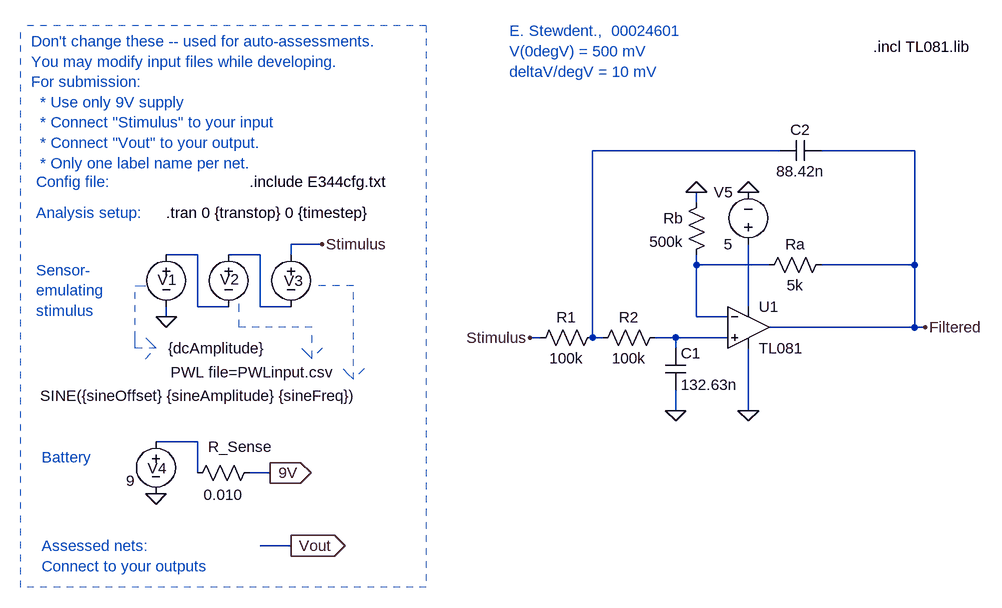
[diagram p0: schematic _Noninverting_2nd_Order_TL081.asc]
_Noninverting_2nd_Order_TL081.asc, the LTspice schematic file:
Version 4
SHEET 1 1824 680
WIRE -1136 -1216 -1424 -1216
WIRE -928 -1216 -1072 -1216
WIRE -1264 -1136 -1264 -1152
WIRE -1840 -1072 -1888 -1072
WIRE -2032 -1056 -2080 -1056
WIRE -1936 -1056 -1984 -1056
WIRE -1888 -1056 -1888 -1072
WIRE -1264 -1040 -1264 -1056
WIRE -1152 -1040 -1264 -1040
WIRE -928 -1040 -928 -1216
WIRE -928 -1040 -1072 -1040
WIRE -2032 -976 -2032 -1056
WIRE -1984 -976 -2032 -976
WIRE -1936 -976 -1936 -1056
WIRE -1888 -976 -1936 -976
WIRE -1184 -976 -1184 -1072
WIRE -2080 -960 -2080 -976
WIRE -1264 -960 -1264 -1040
WIRE -1216 -960 -1264 -960
WIRE -928 -944 -928 -1040
WIRE -928 -944 -1152 -944
WIRE -912 -944 -928 -944
WIRE -1504 -928 -1520 -928
WIRE -1424 -928 -1424 -1216
WIRE -1408 -928 -1424 -928
WIRE -1296 -928 -1328 -928
WIRE -1216 -928 -1296 -928
WIRE -1296 -912 -1296 -928
WIRE -1296 -816 -1296 -848
WIRE -1184 -816 -1184 -912
WIRE -2032 -768 -2096 -768
WIRE -2032 -720 -2032 -768
WIRE -1920 -720 -1952 -720
WIRE -1888 -608 -1936 -608
FLAG -2080 -960 0
FLAG -1840 -1072 Stimulus
FLAG -1920 -720 9V
IOPIN -1920 -720 Out
FLAG -2096 -688 0
FLAG -1888 -608 Vout
IOPIN -1888 -608 Out
FLAG -1520 -928 Stimulus
FLAG -912 -944 Filtered
FLAG -1184 -816 0
FLAG -1296 -816 0
FLAG -1184 -1152 0
FLAG -1264 -1152 0
SYMBOL voltage -1984 -1072 R0
WINDOW 123 0 0 Left 0
WINDOW 39 0 0 Left 0
WINDOW 3 -89 197 Left 2
WINDOW 0 -13 54 Left 2
SYMATTR Value PWL file=PWLinput.csv
SYMATTR InstName V2
SYMBOL voltage -1888 -1072 R0
WINDOW 123 24 44 Left 2
WINDOW 39 0 0 Left 0
WINDOW 3 -386 233 Left 2
WINDOW 0 -11 56 Left 2
SYMATTR Value SINE({sineOffset} {sineAmplitude} {sineFreq})
SYMATTR InstName V3
SYMBOL voltage -2080 -1072 R0
WINDOW 123 0 0 Left 0
WINDOW 39 0 0 Left 0
WINDOW 3 3 160 Left 2
WINDOW 0 -13 55 Left 2
SYMATTR Value {dcAmplitude}
SYMATTR InstName V1
SYMBOL voltage -2096 -784 R0
WINDOW 123 24 44 Left 2
WINDOW 39 0 0 Left 0
WINDOW 3 -46 76 Left 2
WINDOW 0 -13 57 Left 2
SYMATTR Value 9
SYMATTR InstName V4
SYMBOL res -1936 -736 R90
WINDOW 0 -9 30 VBottom 2
WINDOW 3 34 56 VTop 2
SYMATTR InstName R_Sense
SYMATTR Value 0.010
SYMBOL res -1408 -944 R90
WINDOW 0 0 56 VBottom 2
WINDOW 3 32 56 VTop 2
SYMATTR InstName R1
SYMATTR Value 100k
SYMBOL cap -1312 -912 R0
SYMATTR InstName C1
SYMATTR Value 132.63n
SYMBOL Opamps\\opamp2 -1184 -1008 R0
SYMATTR InstName U1
SYMATTR Value TL081
SYMBOL voltage -1184 -1056 R180
WINDOW 0 24 96 Left 2
WINDOW 3 24 16 Left 2
WINDOW 123 0 0 Left 0
WINDOW 39 0 0 Left 0
SYMATTR InstName V5
SYMATTR Value 5
SYMBOL res -1312 -944 R90
WINDOW 0 0 56 VBottom 2
WINDOW 3 32 56 VTop 2
SYMATTR InstName R2
SYMATTR Value 100k
SYMBOL res -1056 -1056 R90
WINDOW 0 0 56 VBottom 2
WINDOW 3 32 56 VTop 2
SYMATTR InstName Ra
SYMATTR Value 5k
SYMBOL res -1248 -1152 M0
SYMATTR InstName Rb
SYMATTR Value 500k
SYMBOL cap -1072 -1232 R90
WINDOW 0 0 32 VBottom 2
WINDOW 3 32 32 VTop 2
SYMATTR InstName C2
SYMATTR Value 88.42n
TEXT -2080 -1120 Left 2 !.tran 0 {transtop} 0 {timestep}
TEXT -1952 -1168 Left 2 !.include E344cfg.txt
TEXT -2288 -1384 Left 2 ;Don't change these -- used for auto-assessments.\nYou may modify input files while developing.\nFor submission: \n  * Use only 9V supply \n  * Connect "Stimulus" to your input\n  * Connect "Vout" to your output.\n  * Only one label name per net.
TEXT -2280 -1168 Left 2 ;Config file:
TEXT -2280 -1120 Left 2 ;Analysis setup:
TEXT -2272 -744 Left 2 ;Battery
TEXT -2280 -1032 Left 2 ;Sensor-\nemulating \nstimulus
TEXT -2272 -608 Left 2 ;Assessed nets:\nConnect to your outputs
TEXT -1552 -1400 Left 2 ;E. Stewdent.,  00024601\nV(0degV) = 500 mV\ndeltaV/degV = 10 mV
TEXT -992 -1376 Left 2 !.incl TL081.lib
LINE Normal -1792 -1008 -1856 -1008 2
LINE Normal -1792 -864 -1792 -1008 2
LINE Normal -1808 -880 -1792 -864 2
LINE Normal -1792 -864 -1808 -880 2
LINE Normal -1776 -880 -1792 -864 2
LINE Normal -2128 -1008 -2112 -1008 2
LINE Normal -2128 -928 -2128 -1008 2
LINE Normal -2128 -912 -2128 -928 2
LINE Normal -2096 -912 -2128 -912 2
LINE Normal -2112 -928 -2096 -912 2
LINE Normal -2096 -912 -2112 -928 2
LINE Normal -2112 -896 -2096 -912 2
LINE Normal -1968 -944 -1968 -992 2
LINE Normal -1856 -944 -1968 -944 2
LINE Normal -1856 -896 -1856 -944 2
LINE Normal -1872 -912 -1856 -896 2
LINE Normal -1856 -896 -1872 -912 2
LINE Normal -1840 -912 -1856 -896 2
LINE Normal -2304 -544 -2304 -1408 1
LINE Normal -1680 -1408 -1680 -544 1
LINE Normal -1680 -544 -2304 -544 1
LINE Normal -1680 -1408 -2304 -1408 1

The netlist it stands for:
* _Noninverting_2nd_Order_TL081.asc
V2 N003 N002 PWL file=PWLinput.csv
V3 Stimulus N003 SINE({sineOffset} {sineAmplitude} {sineFreq})
V1 N002 0 {dcAmplitude}
V4 N007 0 9
R_Sense 9V N007 0.010
R1 N001 Stimulus 100k
C1 N006 0 132.63n
XU1 N006 N004 N005 0 Filtered TL081  ; pins In+ In- V+ V- OUT
V5 N005 0 5
R2 N006 N001 100k
Ra Filtered N004 5k
Rb 0 N004 500k
C2 Filtered N001 88.42n
.tran 0 {transtop} 0 {timestep}
.include E344cfg.txt
* Don't change these -- used for auto-assessments.
* You may modify input files while developing.
* For submission:
*   * Use only 9V supply
*   * Connect "Stimulus" to your input
*   * Connect "Vout" to your output.
*   * Only one label name per net.
* Config file:
* Analysis setup:
* Battery
* Sensor-
* emulating
* stimulus
* Assessed nets:
* Connect to your outputs
* E. Stewdent.,  00024601
* V(0degV) = 500 mV
* deltaV/degV = 10 mV
.incl TL081.lib
.backanno
.end